# EAGLE design TOTAL ON EAGLE_B (EAGLE 6.4)
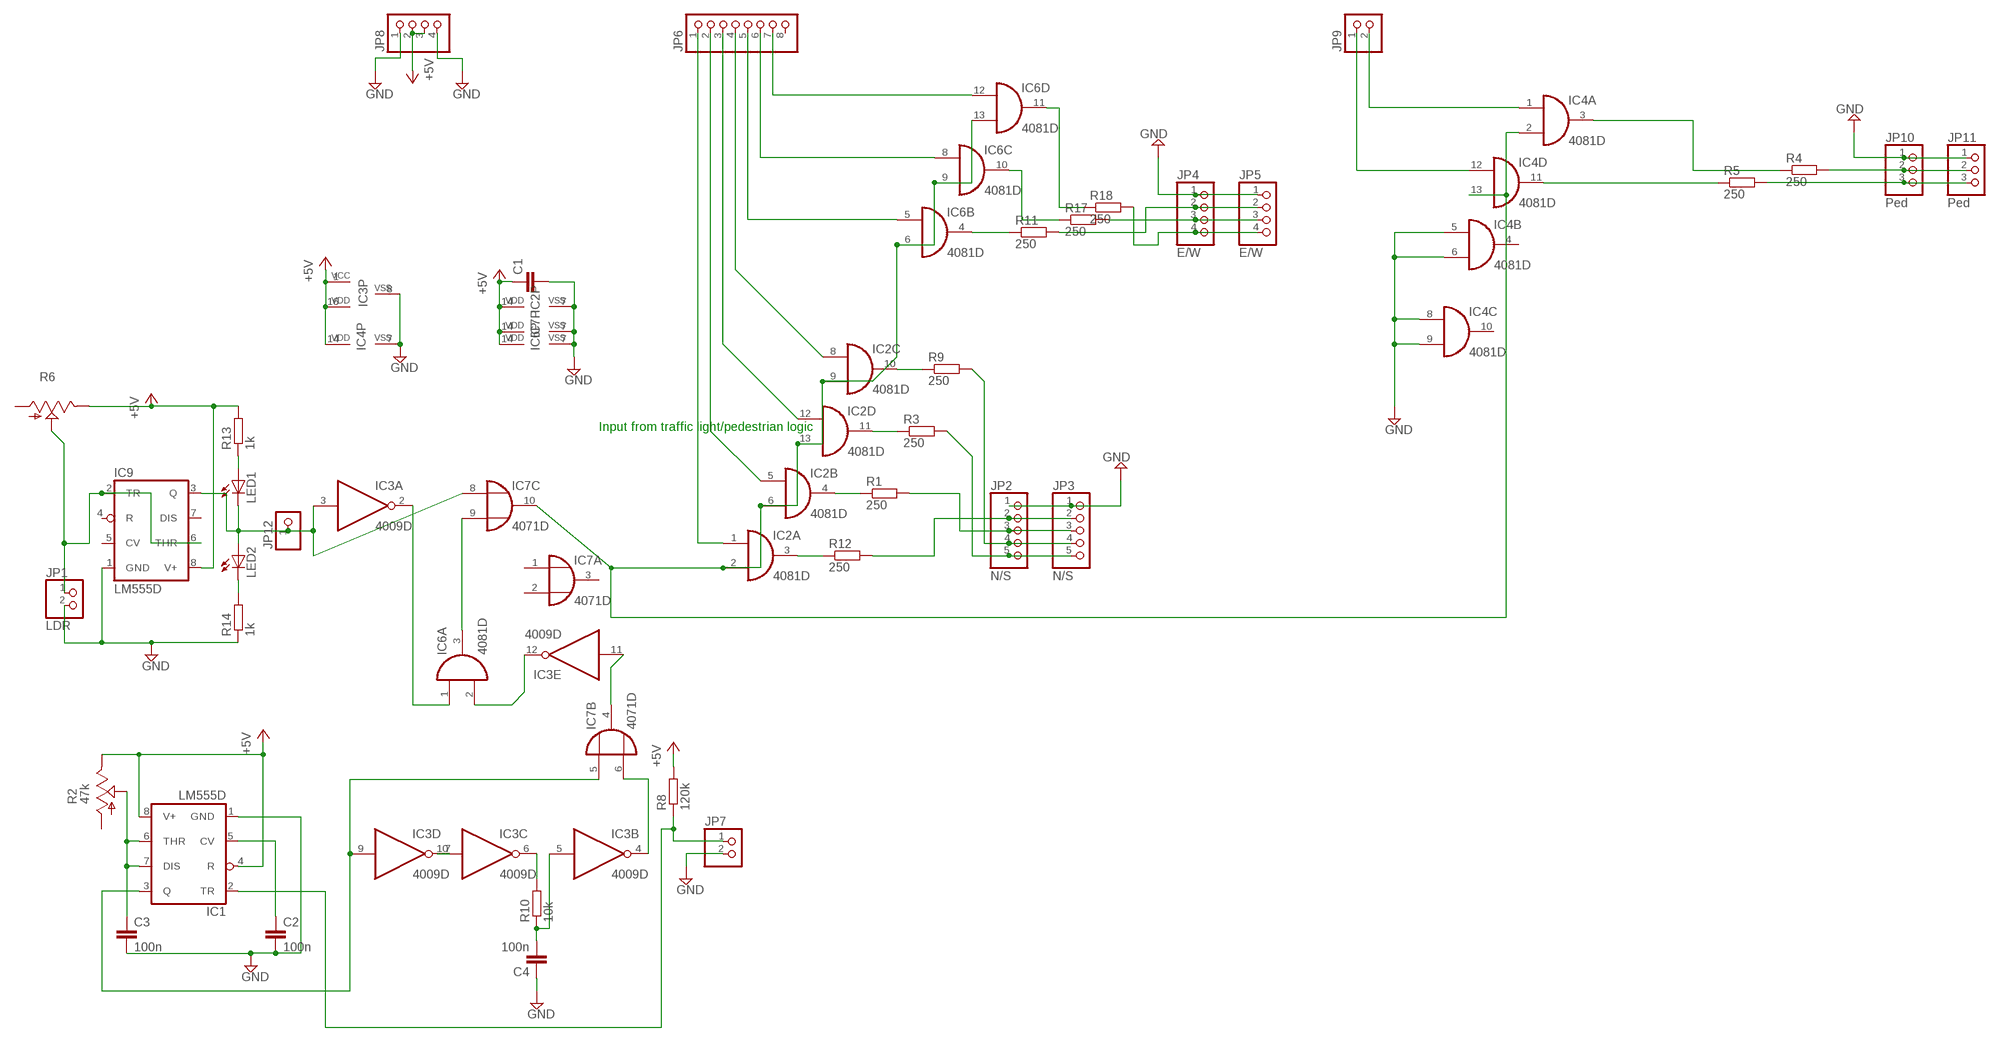
[diagram p0: schematic, sheet 1]

## Parts
C1  C-EUC0805  [C0805]
C2  100n  C-EUC0805  [C0805]
C3  100n  C-EUC0805  [C0805]
C4  100n  C-EUC0805  [C0805]
IC1  LM555D  [SO08]
IC2  4081D  [SO14]
IC3  4009D  [SO16]
IC4  4081D  [SO14]
IC6  4081D  [SO14]
IC7  4071D  [SO14]
IC9  LM555D  [SO08]
JP1  LDR  PINHD-1X2  [1X02]
JP2  N/S  PINHD-1X5  [1X05]
JP3  N/S  PINHD-1X5  [1X05]
JP4  E/W  PINHD-1X4  [1X04]
JP5  E/W  PINHD-1X4  [1X04]
JP6  PINHD-1X8  [1X08]
JP7  PINHD-1X2  [1X02]
JP8  PINHD-1X4  [1X04]
JP9  PINHD-1X2  [1X02]
JP10  Ped  PINHD-1X3  [1X03]
JP11  Ped  PINHD-1X3  [1X03]
JP12  PINHD-1X1  [1X01]
LED1  LEDSML0805  [SML0805]
LED2  LEDSML0805  [SML0805]
R1  250  R-EU_M0805  [M0805]
R2  47k  TRIM_US-B64W  [B64W]
R3  250  R-EU_M0805  [M0805]
R4  250  R-EU_M0805  [M0805]
R5  250  R-EU_M0805  [M0805]
R6  TRIM_US-B25P  [B25P]
R8  120k  R-EU_M0805  [M0805]
R9  250  R-EU_M0805  [M0805]
R10  10k  R-EU_M0805  [M0805]
R11  250  R-EU_M0805  [M0805]
R12  250  R-EU_M0805  [M0805]
R13  1k  R-EU_M0805  [M0805]
R14  1k  R-EU_M0805  [M0805]
R17  250  R-EU_M0805  [M0805]
R18  250  R-EU_M0805  [M0805]

## Nets
+5V: C1.1 IC1.4(R) IC1.8(V+) IC2.14(P:VDD) IC3.1(P:VCC) IC3.16(P:VDD) IC4.14(P:VDD) IC6.14(P:VDD) IC7.14(P:VDD) IC9.8(V+) JP8.2 JP8.3 R2.E R6.E R8.2 R13.2
GND: C1.2 C2.2 C3.2 C4.1 IC1.1(GND) IC2.7(P:VSS) IC3.8(P:VSS) IC4.5(B:I0) IC4.6(B:I1) IC4.7(P:VSS) IC4.8(C:I0) IC4.9(C:I1) IC6.7(P:VSS) IC7.7(P:VSS) IC9.1(GND) JP1.2 JP2.1 JP3.1 JP4.1 JP5.1 JP7.2 JP8.1 JP8.4 JP10.1 JP11.1 R14.1
N$1: C2.1 IC1.5(CV)
N$2: IC2.4(B:O) R1.1
N$3: IC3.4(B:O) IC7.6(B:I1)
N$4: IC2.3(A:O) R12.1
N$5: JP2.3 JP3.3 R1.2
N$6: JP10.2 JP11.2 R4.2
N$7: JP10.3 JP11.3 R5.2
N$8: JP4.3 JP5.3 R17.2
N$9: IC4.12(D:I0) JP9.1
N$10: IC4.1(A:I0) JP9.2
N$11: IC2.11(D:O) R3.1
N$12: IC4.3(A:O) R4.1
N$13: JP2.5 JP3.5 R3.2
N$14: IC1.2(TR) JP7.1 R8.1
N$15: IC4.11(D:O) R5.1
N$16: IC2.10(C:O) R9.1
N$17: IC1.3(Q) IC3.9(D:I) IC7.5(B:I0)
N$18: JP2.4 JP3.4 R9.2
N$19: IC3.2(A:O) IC6.1(A:I0)
N$20: IC6.3(A:O) IC7.9(C:I1)
N$21: IC3.12(E:O) IC6.2(A:I1)
N$22: C3.1 IC1.6(THR) IC1.7(DIS) R2.S
N$23: IC3.7(C:I) IC3.10(D:O)
N$24: C4.2 IC3.5(B:I) R10.1
N$25: IC2.2(A:I1) IC2.6(B:I1) IC2.9(C:I1) IC2.13(D:I1) IC4.2(A:I1) IC4.13(D:I1) IC6.6(B:I1) IC6.9(C:I1) IC6.13(D:I1) IC7.10(C:O)
N$26: IC2.1(A:I0) JP6.1
N$27: LED1.A R13.1
N$28: IC3.3(A:I) IC7.8(C:I0) IC9.3(Q) JP12.1 LED1.C LED2.A
N$29: LED2.C R14.2
N$30: IC3.6(C:O) R10.2
N$31: IC9.2(TR) IC9.6(THR) JP1.1 R6.S
N$33: IC2.5(B:I0) JP6.2
N$34: IC2.12(D:I0) JP6.3
N$35: IC2.8(C:I0) JP6.4
N$36: IC6.5(B:I0) JP6.5
N$37: JP2.2 JP3.2 R12.2
N$38: IC6.8(C:I0) JP6.6
N$39: IC6.12(D:I0) JP6.7
N$40: JP4.4 JP5.4 R18.2
N$41: IC3.11(E:I) IC7.4(B:O)
N$42: IC6.11(D:O) R18.1
N$43: IC6.10(C:O) R17.1
N$44: JP4.2 JP5.2 R11.2
N$45: IC6.4(B:O) R11.1
Unconnected: IC3.14(F:I) IC3.15(F:O) IC4.4(B:O) IC4.10(C:O) IC7.1(A:I0) IC7.2(A:I1) IC7.3(A:O) IC7.11(D:O) IC7.12(D:I0) IC7.13(D:I1) IC9.4(R) IC9.5(CV) IC9.7(DIS) JP6.8 R2.A R6.A

## Notes on the sheet
- Input from traffic light/pedestrian logic

## Library data of the parts
C1-C4 = resistor:C-EU: CAPACITOR, European symbol
IC1 IC9 = linear:*555: TIMER
IC2 IC4 IC6 = 40xx:4081: Quad 2-input AND
IC3 = 40xx:4009: Hex BUFFER, inverting
IC7 = 40xx:4071: Quad 2-input OR
JP1 JP7 JP9 = pinhead:PINHD-1X2: PIN HEADER
JP2 JP3 = pinhead:PINHD-1X5: PIN HEADER
JP4 JP5 JP8 = pinhead:PINHD-1X4: PIN HEADER
JP6 = pinhead:PINHD-1X8: PIN HEADER
JP10 JP11 = pinhead:PINHD-1X3: PIN HEADER
JP12 = pinhead:PINHD-1X1: PIN HEADER
LED1 LED2 = led:LED: LED OSRAM: - CHIPLED LG R971, LG N971, LY N971, LG Q971, LY Q971, LO R971, LY R971 LH N974, LH R974 LS Q976, LO Q976, LY Q976 LO Q996 - Hyper CHIPLED LW Q18S LB Q993, LB Q99A, LB R99A - SideLED LS A670, LO A670, LY A670, LG A670, LP A670 LB A673, LV A673, LT A673, LW A673 LH A674 LY A675 LS A676, LA A676, LO A676, LY A676, LW A676 LS A679, LY A679, LG A679 - Hyper Micro SIDELED® LS Y876, LA Y876, LO Y876, LY Y876 LT Y87S - SmartLED LW L88C, LW L88S LB L89C, LB L89S, LG L890 LS L89K, LO L89K, LY L89K LS L896, LA L896, LO L896, LY L896 - TOPLED LS T670, LO T670, LY T670, LG T670, LP T670 LSG T670, LSP T670, LSY T670, LOP T670, LYG T670 LG T671, LOG T671, LSG T671 LB T673, LV T673, LT T673, LW T673 LH T674 LS T676, LA T676, LO T676, LY T676, LB T676, LH T676, LSB T676, LW T676 LB T67C, LV T67C, LT T67C, LS T67K, LO T67K, LY T67K, LW E67C LS E67B, LA E67B, LO E67B, LY E67B, LB E67C, LV E67C, LT E67C LW T67C LS T679, LY T679, LG T679 LS T770, LO T770, LY T770, LG T770, LP T770 LB T773, LV T773, LT T773, LW T773 LH T774 LS E675, LA E675, LY E675, LS T675 LS T776, LA T776, LO T776, LY T776, LB T776 LHGB T686 LT T68C, LB T68C - Hyper Mini TOPLED® LB M676 - Mini TOPLED Santana® LG M470 LS M47K, LO M47K, LY M47K Source: http://www.osram.convergy.de LUXEON: - LUMILED® LXK2-PW12-R00, LXK2-PW12-S00, LXK2-PW14-U00, LXK2-PW14-V00 LXK2-PM12-R00, LXK2-PM12-S00, LXK2-PM14-U00 LXK2-PE12-Q00, LXK2-PE12-R00, LXK2-PE12-S00, LXK2-PE14-T00, LXK2-PE14-U00 LXK2-PB12-K00, LXK2-PB12-L00, LXK2-PB12-M00, LXK2-PB14-N00, LXK2-PB14-P00, LXK2-PB14-Q00 LXK2-PR12-L00, LXK2-PR12-M00, LXK2-PR14-Q00, LXK2-PR14-R00 LXK2-PD12-Q00, LXK2-PD12-R00, LXK2-PD12-S00 LXK2-PH12-R00, LXK2-PH12-S00 LXK2-PL12-P00, LXK2-PL12-Q00, LXK2-PL12-R00 Source: www.luxeon.com KINGBRIGHT: KA-3528ASYC Source: www.kingbright.com
R1 R3-R5 R8-R14 R17 R18 = resistor:R-EU_: RESISTOR, European symbol
R2 R6 = pot:TRIM_US-: POTENTIOMETER

## Board
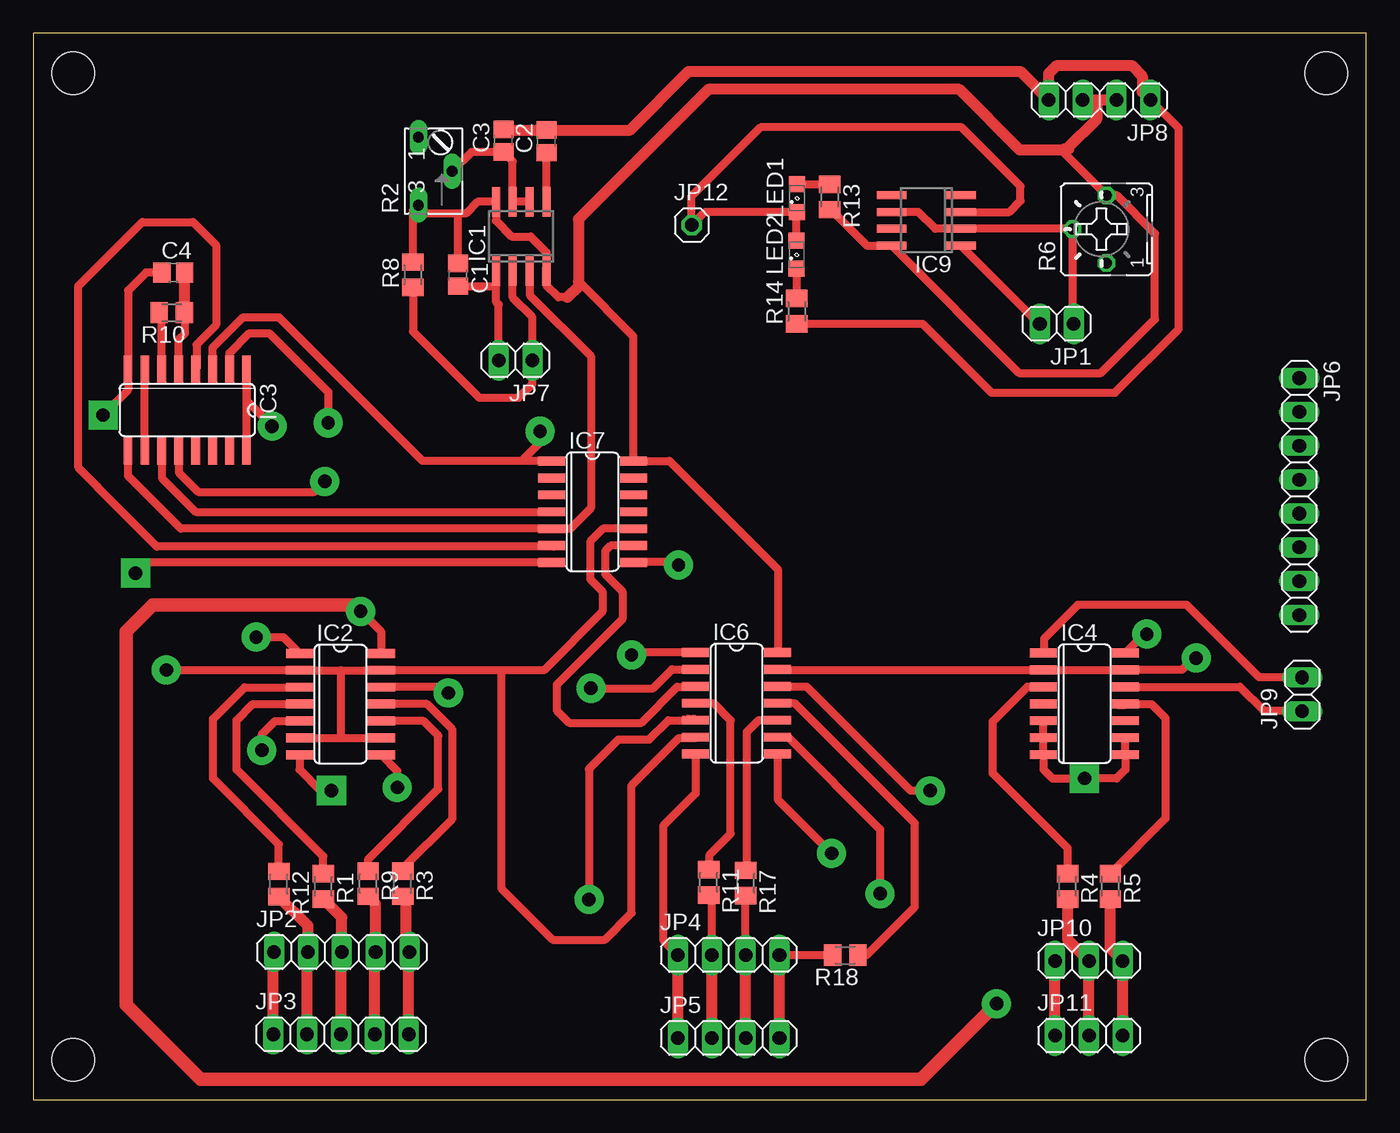
[diagram p1: board, top side]
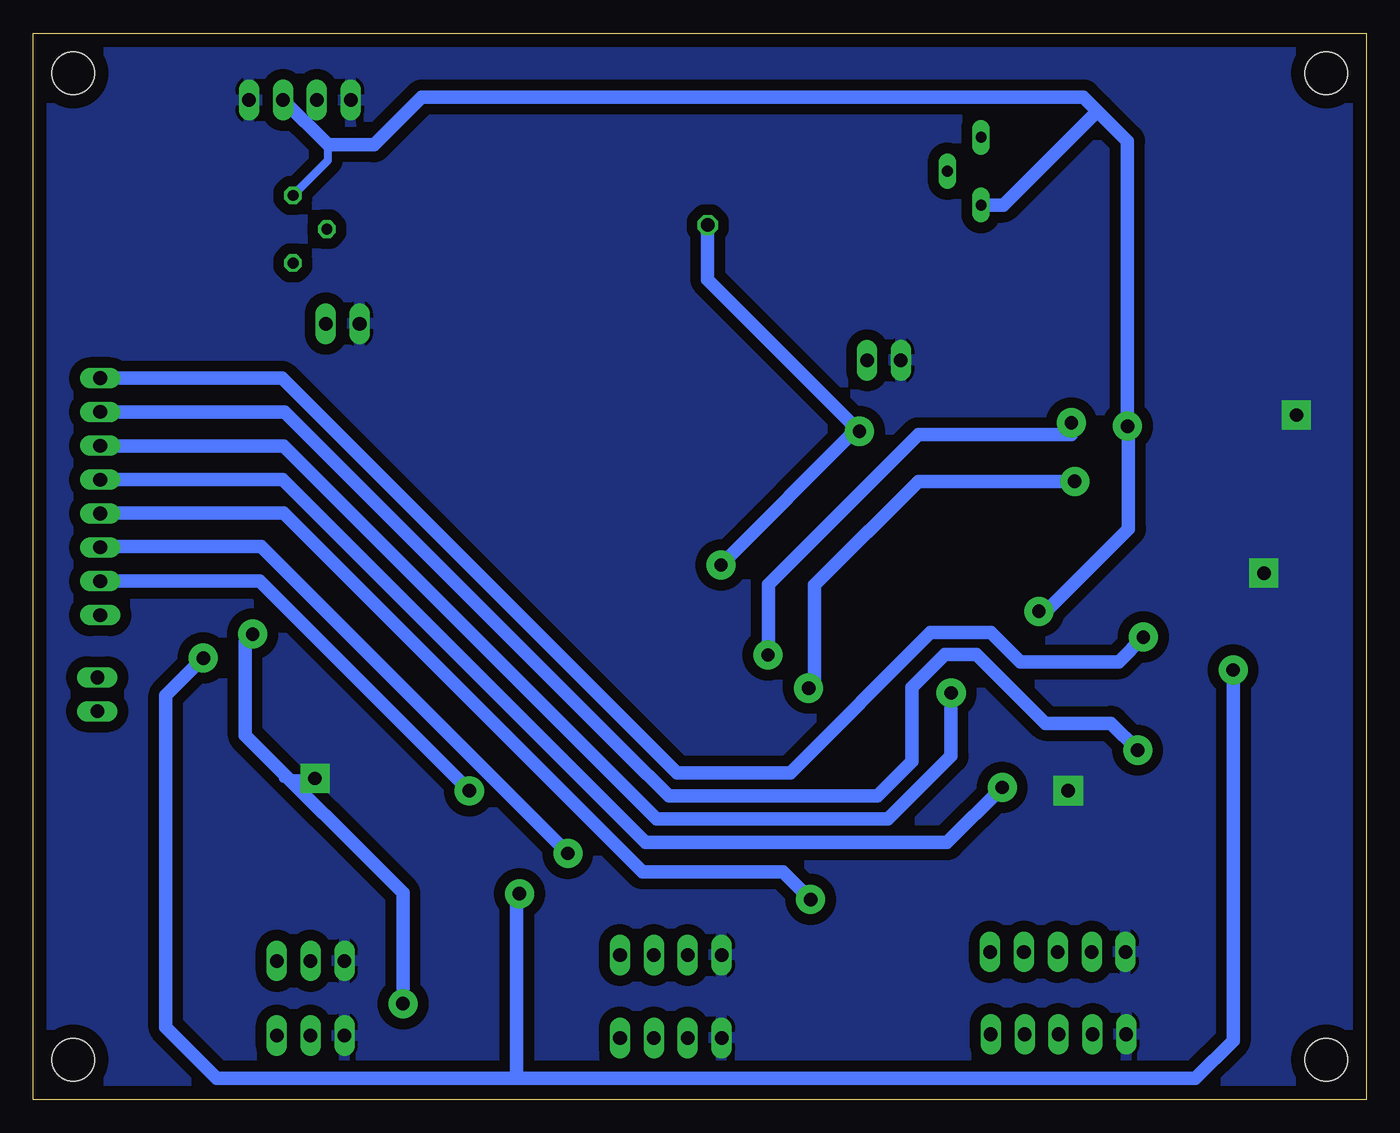
[diagram p2: board, bottom side, seen from below]

Size 100 x 80 mm. Coordinates in mm from the lower left corner, seen from the top.
Outline: 0,0 100,0 100,80 0,80 0,0
Copper layers (1*16): Top 0.035mm / dielectric 1.5mm / Bottom 0.035mm
Design rules "default": minimum track width 10mil, minimum drill 24mil, track to track 8mil, track to pad 8mil, pad to pad 8mil, via to via 8mil, smd to smd 8mil, copper to edge 40mil, drill to drill 8mil, minimum pad ring 10mil, minimum via ring 8mil, stop-mask expansion 4mil, vias tented up to drill 0mil, thermal gap 10mil
Holes 3.2 mm at 3,3 97,3 97,77 3,77

### Footprints (pad centres in the part's own frame; a part is rotated, then mirrored left to right if it is on the bottom)
C0805 = smd 1.3 x 1.5: 1 -0.85,0; 2 0.85,0
SO08 = smd 0.6 x 2.2: 1 -1.905,-2.6; 2 -0.635,-2.6; 3 0.635,-2.6; 4 1.905,-2.6; 5 1.905,2.6; 6 0.635,2.6; 7 -0.635,2.6; 8 -1.905,2.6
SO14 = smd 0.66 x 2.032: 1 -3.81,-3.073; 2 -2.54,-3.073; 3 -1.27,-3.073; 4 0,-3.073; 5 1.27,-3.073; 6 2.54,-3.073; 7 3.81,-3.073; 8 3.81,3.073; 9 2.54,3.073; 10 1.27,3.073; 11 0,3.073; 12 -1.27,3.073; 13 -2.54,3.073; 14 -3.81,3.073
SO16 = smd 0.66 x 2.032: 1 -4.445,-3.073; 2 -3.175,-3.073; 3 -1.905,-3.073; 4 -0.635,-3.073; 5 0.635,-3.073; 6 1.905,-3.073; 7 3.175,-3.073; 8 4.445,-3.073; 9 4.445,3.073; 10 3.175,3.073; 11 1.905,3.073; 12 0.635,3.073; 13 -0.635,3.073; 14 -1.905,3.073; 15 -3.175,3.073; 16 -4.445,3.073
1X02 = drill 1.016 long: 1 -1.27,0; 2 1.27,0
1X05 = drill 1.016 long: 1 -5.08,0; 2 -2.54,0; 3 0,0; 4 2.54,0; 5 5.08,0
1X04 = drill 1.016 long: 1 -3.81,0; 2 -1.27,0; 3 1.27,0; 4 3.81,0
1X08 = drill 1.016 long: 1 -8.89,0; 2 -6.35,0; 3 -3.81,0; 4 -1.27,0; 5 1.27,0; 6 3.81,0; 7 6.35,0; 8 8.89,0
1X03 = drill 1.016 long: 1 -2.54,0; 2 0,0; 3 2.54,0
1X01 = drill 1.016 octagon: 1 0,0
SML0805 = smd 1.2 x 1.2: A 1.05,0; C -1.05,0
M0805 = smd 1.3 x 1.6: 1 -0.95,0; 2 0.95,0
B64W = drill 0.813 long: A 2.54,0; E -2.54,0; S 0,-2.54
B25P = drill 0.813 octagon: A -2.54,0; E 2.54,0; S 0,2.54

### Placement (x,y rotation side)
C1  31.85,61.88 270 top
C2  38.49,71.9 90 top
C3  35.27,71.95 90 top
C4  10.51,62.04 0 top
IC1  36.61,64.76 0 top
IC2  23.04,29.67 270 top
IC3  11.55,51.73 180 top
IC4  78.87,29.69 270 top
IC6  52.76,29.73 270 top
IC7  41.95,44.1 270 top
IC9  67.01,65.96 90 top
JP1  76.79,58.21 180 top
JP2  23.14,11.07 0 top
JP3  23.08,4.89 0 top
JP4  52.17,10.84 0 top
JP5  52.17,4.62 0 top
JP6  94.98,45.24 270 top
JP7  36.18,55.46 180 top
JP8  80,75 180 top
JP9  95.2,30.4 90 top
JP10  79.2,10.4 0 top
JP11  79.2,4.8 0 top
JP12  49.4,65.61 0 top
LED1  57.3,67.63 90 top
LED2  57.27,63.38 90 top
R1  21.76,15.99 270 top
R2  28.89,69.66 90 top
R3  27.72,16.2 270 top
R4  77.6,16 270 top
R5  80.8,16 270 top
R6  80.52,65.3 90 top
R8  28.48,61.88 90 top
R9  25.12,16.2 270 top
R10  10.4,59.04 180 top
R11  50.67,16.3 270 top
R12  18.42,16.18 270 top
R13  59.75,67.71 270 top
R14  57.28,59.15 90 top
R17  53.45,16.25 270 top
R18  60.92,10.83 180 top

### Tracks (layer width: path | path; a pad name or v marks a point on that pad's centre or on a via)
+5V  (via drill 1 pad 2.18)
  Top 0.61: IC3.16 IC3.1 15.99,52.44 v17.91,50.52 | 31.85,66.47 32.46,66.47 33.34,67.36 IC1.8 34.7,65.93 35.89,64.75 37.31,64.75 38.51,63.54 IC1.4 | 31.85,66.47 29.53,66.47 R2.E 28.48,66.7 R8.2 | C1.1 31.85,66.47 | IC2.14 26.11,35.08 v24.56,36.63 | 40.08,60.2 39.4,60.2 38.48,61.11 38.48,62.46 38.53,62.51 | IC6.14 55.85,33.56 55.85,39.78 47.72,47.91 IC7.14 45.03,57.26 40.89,61.39 | v83.54,34.92 83.37,34.92 IC4.14 | 77.6,71.3 77.47,71.42 77.32,71.42 77.32,71.04 R6.E 81.28,67.84 84.15,64.97 84.15,58.55 80.11,54.51 73.96,54.51 IC9.8 64.39,64.08 62.53,64.08 59.85,66.76 R13.2 | 77.6,71.3 77.65,71.25 77.75,71.25 | 77.8,71.25 77.75,71.25 | 77.75,71.25 77.7,71.3 77.6,71.3 | 77.6,71.3 77.52,71.3
  Top 0.813: JP8.2 79.78,75 | 79.78,75 JP8.3 | 79.78,75 79.78,73.55 77.52,71.3 77.47,71.25 74.02,71.25 69.47,75.79 50.65,75.79 40.89,66.04 40.89,61.39 40.89,61.01 40.08,60.2
  Top 1.016: v72.26,7.19 66.6,1.52 12.55,1.52 6.96,7.11 6.96,35.13 8.94,37.11 24.08,37.11 v24.56,36.63
  Bottom 0.61: R6.E 77.9,70.46 77.9,71.63
  Bottom 1.016: 20.17,74.17 17.91,71.91 v17.91,50.52 17.83,50.44 17.83,42.82 24.03,36.63 v24.56,36.63 | JP8.2 77.9,71.63 74.45,71.63 70.87,75.21 21.21,75.21 20.17,74.17 | R2.E 27.22,67.11 20.17,74.17 | v72.26,7.19 72.26,15.49 84.1,27.33 84.1,34.37 v83.54,34.92
GND  (via drill 1 pad 2.18)
  Top 0.61: IC2.7 19.97,24.77 21.56,23.18 v22.36,23.18 | C4.1 8.45,62.04 7.11,60.71 7.11,54.81 | 7.11,54.81 IC3.8 | 7.11,54.81 7.11,53.24 v5.23,51.36 | C2.2 35.32,72.75 C3.2 | JP7.2 34.91,59.65 34.72,59.84 34.72,61.09 | 34.72,61.09 34.72,62.14 IC1.1 | C1.2 34.66,61.03 34.72,61.09 | IC4.5 IC4.6 IC4.7 75.8,24.76 76.47,24.09 v78.87,24.09 81.27,24.09 81.94,24.76 IC4.8 IC4.9 | IC6.7 49.69,22.97 47.24,20.52 47.24,11.96 JP4.1 | IC7.7 8.47,40.29 v7.67,39.5 | IC9.1 75.46,58.21 JP1.2 | R14.1 66.71,58.2 71.88,53.03 81.15,53.03 85.93,57.81 85.93,72.88 JP8.1
  Top 0.813: JP11.1 JP10.1 | JP5.1 JP4.1 | JP3.1 18,11.02 JP2.1 | JP8.1 83.2,75.61 83.2,76.8 82.4,77.6 76.8,77.6 76.19,76.99 JP8.4 74.05,77.14 49.17,77.14 44.78,72.75 35.32,72.75
  Bottom 0.61: v22.36,23.18 23.16,22.38 | v78.87,24.09 81.27,24.09 | v5.23,51.36 5.23,51.18 5.13,51.08 5.61,51.08 5.74,50.95
  pour Bottom (isolate 0.813): 0,0 100,0 100,80 0,80
N$1
  Top 0.61: IC1.5 38.51,71.03 C2.1
N$2
  Top 0.61: R1.1 21.76,18.25 15.24,24.77 15.24,28.45 16.46,29.67 IC2.4
N$3
  Top 0.61: IC7.6 38.98,41.56 39.06,41.48 9.27,41.48 4.8,45.95 4.8,46 3.38,47.42 3.38,61.04 8.18,65.84 11.99,65.84 13.72,64.11 13.72,58.12 12.24,56.64 12.24,54.86 IC3.4
N$4
  Top 0.61: R12.1 18.42,19.15 13.49,24.08 13.49,28.57 15.85,30.94 IC2.3
N$5
  Top 0.813: JP3.3 23.08,11.02 JP2.3 23.14,13.66 R1.2
N$6
  Top 0.813: JP11.2 JP10.2 77.6,12 R4.2
N$7
  Top 0.813: JP11.3 JP10.3 80.8,11.34 R5.2
N$8
  Top 0.61: JP4.3 R17.2
  Top 0.813: JP5.3 JP4.3
N$9
  Top 0.61: IC4.12 90.53,30.96 92.3,29.18 95.14,29.18 JP9.1
N$10
  Top 0.61: JP9.2 91.98,31.67 86.54,37.11 78.36,37.11 75.82,34.57 75.82,33.52 IC4.1
N$11
  Top 0.61: R3.1 27.72,17.33 31.45,21.06 31.45,27.76 29.54,29.67 IC2.11
N$12
  Top 0.61: R4.1 77.6,18.84 71.98,24.46 71.98,28.37 74.57,30.96 IC4.3
N$13
  Top 0.813: JP3.5 28.16,11.02 JP2.5 28.22,11.57 27.96,11.84 27.96,15.01 R3.2
N$14
  Top 0.61: IC1.2 35.97,62.15 35.97,60.17 37.45,58.69 JP7.1 37.44,53.67 36.42,52.65 33.45,52.65 28.48,57.63 R8.1
N$15
  Top 0.61: 80.8,17.27 R5.1 84.94,21.09 84.94,28.63 83.9,29.67 81.48,29.67 81.41,29.59 81.84,29.59 IC4.11
N$16
  Top 0.61: R9.1 25.12,18.03 30.38,23.29 30.38,27.3 29.28,28.4 IC2.10
N$17
  Top 0.61: IC3.9 7.11,48.64 7.11,46.79 11.07,42.83 IC7.5 40.26,42.82 41.83,44.4 41.83,55.78 37.24,60.37 IC1.3
N$18
  Top 0.813: JP3.4 25.62,11.02 JP2.4 25.68,14.69 R9.2
N$19  (via drill 1 pad 2.18)
  Top 0.61: IC3.2 14.72,56.02 16.2,57.51 17.7,57.51 22.12,53.09 v22.12,50.77 | IC6.1 45.08,33.54 v44.88,33.35
  Bottom 1.016: v22.12,50.77 22.12,49.89 33.6,49.89 44.86,38.63 44.86,33.48 44.81,33.43 v44.88,33.35
N$20
  Top 0.61: IC7.9 43.31,41.56 42.9,41.15 42.9,39.42 44.2,38.12 44.2,36.04 39.27,31.11 39.27,29.21 40.21,28.27 45.62,28.27 48.31,30.96 49.65,30.96 IC6.3
N$21  (via drill 1 pad 2.18)
  Top 0.61: IC3.12 10.91,47.05 12.37,45.59 21.08,45.59 v21.87,46.38 | v41.83,30.86 46.48,30.86 47.9,32.28 49.68,32.28 IC6.2
  Bottom 1.016: 21.95,46.38 v21.87,46.38 33.58,46.38 37.34,42.62 37.36,42.62 41.38,38.61 41.38,31.32 v41.83,30.86
N$22
  Top 0.61: IC1.6 IC1.7 35.97,70.39 C3.1 32.87,71.09 R2.S
N$23
  Top 0.61: IC3.10 IC3.7
N$24
  Top 0.61: IC3.5 10.91,57.04 11.38,57.51 11.38,59.01 R10.1
  Top 0.813: R10.1 C4.2
N$25  (via drill 1 pad 2.18)
  Top 0.61: IC2.6 23.06,27.13 23.06,27.14 | 23.06,32.21 IC2.2 10.01,32.21 v9.98,32.23 | 23.06,32.21 23.06,27.14 | 23.06,27.14 IC2.9 | 23.06,32.21 IC2.13 35,32.21 | IC7.10 42.76,42.83 41.78,41.86 41.78,39.04 42.7,38.12 42.7,36.6 38.3,32.21 35,32.21 | v87.25,33.12 87.07,33.12 86.18,32.23 IC4.13 IC4.2 55.88,32.23 IC6.13 | 35,32.21 35.1,32.11 35.1,15.85 38.96,11.99 42.88,11.99 44.88,13.99 44.88,23.6 44.91,23.6 48.44,27.13 49.62,27.13 IC6.6 | IC6.9 56.6,27.19 63.52,20.27 v63.52,15.44
  Bottom 1.016: v9.98,32.23 9.98,4.42 12.8,1.6 63.73,1.6 | 63.73,1.6 86.23,1.6 90.07,5.44 90.07,30.3 v87.25,33.12 | v63.52,15.44 63.73,15.24 63.73,1.6
N$26  (via drill 1 pad 2.18)
  Top 0.61: v16.71,34.7 18.75,34.7 IC2.1
  Bottom 1.016: JP6.1 81.33,54.13 51.71,24.51 43.2,24.51 32.69,35.03 28.14,35.03 25.96,32.84 18.57,32.84 v16.71,34.7
N$27
  Top 0.61: LED1.A 59.74,68.68 R13.1
N$28  (via drill 1 pad 2.18)
  Top 0.61: IC3.3 13.45,56.4 15.75,58.7 18.41,58.7 29.18,47.93 36.68,47.93 | 36.68,47.93 38.86,47.93 | v38.02,50.14 38.02,49.28 36.68,47.93 | v48.41,40.11 47.8,40.11 47.57,40.34 45.07,40.34 IC7.8 | IC9.3 73.23,66.6 74.07,67.44 74.07,68.53 69.65,72.95 54.56,72.95 49.35,67.74 49.35,65.66 JP12.1 50.38,66.58 LED1.C 57.27,66.56 LED2.A
  Bottom 1.016: JP12.1 49.4,61.52 38.3,50.42 | 38.3,50.42 v38.02,50.14 | 38.3,50.42 38.3,50.22 v48.41,40.11
N$29
  Top 0.61: LED2.C R14.2
N$30
  Top 0.61: IC3.6 9.64,58.84 R10.2
N$31
  Top 0.61: JP1.1 77.98,58.29 R6.S 77.95,65.33 IC9.2 67.67,65.33 66.39,66.6 IC9.6
N$33  (via drill 1 pad 2.18)
  Top 0.61: v17.14,26.21 17.14,27.41 18.14,28.4 IC2.5
  Bottom 1.016: JP6.2 81.16,51.59 55.47,25.91 55.45,25.91 52.32,22.78 36.68,22.78 34.09,25.38 34.09,30.94 31.62,33.4 29.23,33.4 24.05,28.22 19.15,28.22 v17.14,26.21
N$34  (via drill 1 pad 2.18)
  Top 0.61: v31.14,30.5 30.71,30.94 IC2.12
  Bottom 1.016: JP6.3 81.23,49.05 53.24,21.06 35.87,21.06 31.14,25.78 v31.14,30.5
N$35  (via drill 1 pad 2.18)
  Top 0.61: v27.3,23.42 27.3,24.67 IC2.8
  Bottom 1.016: JP6.4 81.28,46.51 54.05,19.28 31.45,19.28 v27.3,23.42
N$36  (via drill 1 pad 2.18)
  Top 0.61: v41.68,15.01 41.68,24.79 43.89,27 46.2,27 47.65,28.45 49.02,28.45 49.15,28.57 49.58,28.57 IC6.5
  Bottom 1.016: JP6.5 94.96,43.99 81.2,43.99 54.3,17.09 43.76,17.09 v41.68,15.01
N$37
  Top 0.813: JP3.2 20.54,11.02 JP2.2 20.6,13.04 R12.2
N$38  (via drill 1 pad 2.18)
  Top 0.61: IC6.8 55.84,22.52 v59.89,18.47
  Bottom 1.016: JP6.6 94.93,41.48 82.91,41.48 v59.89,18.47
N$39  (via drill 1 pad 2.18)
  Top 0.61: IC6.12 55.88,30.96 58.04,30.96 65.84,23.16 v67.28,23.16
  Bottom 1.016: JP6.7 83.01,38.89 v67.28,23.16
N$40
  Top 0.61: R18.2 56,10.83 JP4.4
  Top 0.813: JP5.4 JP4.4
N$41
  Top 0.61: IC3.11 9.64,46.65 12.19,44.09 IC7.4
N$42
  Top 0.61: R18.1 62.52,10.83 66.14,14.45 66.14,20.73 57.15,29.72 55.85,29.72 IC6.11
N$43
  Top 0.61: IC6.10 55.83,28.47 54.43,28.47 53.54,27.58 53.54,17.29 R17.1
N$44
  Top 0.61: JP4.2 50.9,15.11 R11.2
  Top 0.813: JP5.2 JP4.2
N$45
  Top 0.61: IC6.4 49.7,29.72 51.05,29.72 52.32,28.45 52.32,19.94 50.7,18.31 50.7,17.28 R11.1